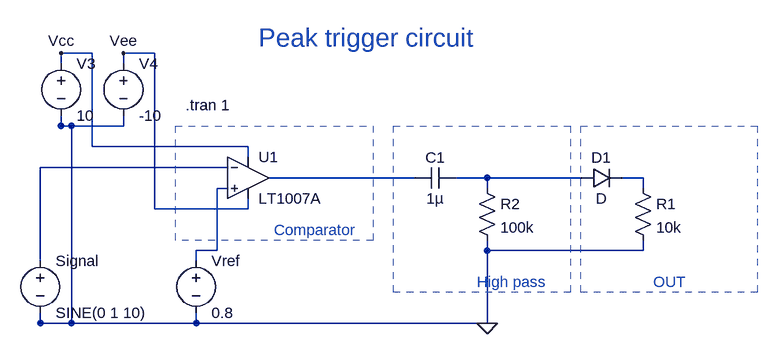
[diagram p0: schematic Peak-trigger-circuit.asc]
Peak-trigger-circuit.asc, the LTspice schematic file:
Version 4.1
SHEET 1 884 680
WIRE 704 208 704 224
WIRE 464 208 464 224
WIRE -224 320 -224 336
WIRE -192 16 -192 32
WIRE -96 16 -96 32
WIRE 16 320 16 336
WIRE 704 224 464 224
WIRE 464 224 464 336
WIRE 464 336 16 336
WIRE 16 336 -224 336
WIRE -224 336 -176 336
WIRE -176 336 -176 32
WIRE -176 32 -192 32
WIRE -192 32 -96 32
FLAG 464 336 0
WIRE -224 240 -224 224
WIRE 64 96 48 96
WIRE -224 224 -224 96
WIRE -224 96 48 96
WIRE 352 112 336 112
WIRE 128 112 144 112
WIRE 336 112 144 112
WIRE 416 112 432 112
WIRE 608 112 592 112
WIRE 464 128 464 112
WIRE 432 112 464 112
WIRE 464 112 592 112
WIRE 672 112 688 112
WIRE 704 128 704 112
WIRE 688 112 704 112
WIRE 64 128 48 128
WIRE 16 240 16 224
WIRE 48 128 48 224
WIRE 48 224 16 224
WIRE 96 80 96 64
WIRE -192 -64 -192 -80
WIRE 96 64 -144 64
WIRE -144 64 -144 -80
WIRE -144 -80 -192 -80
FLAG -192 -80 Vcc
WIRE 96 144 96 160
WIRE -96 -64 -96 -80
WIRE 96 160 -48 160
WIRE -48 160 -48 -80
WIRE -48 -80 -96 -80
FLAG -96 -80 Vee
SYMBOL Opamps\\LT1007A 96 48 R0
SYMATTR InstName U1
SYMBOL voltage -224 224 R0
WINDOW 123 0 0 Left 2
WINDOW 39 0 0 Left 2
SYMATTR InstName Signal
SYMATTR Value SINE(0 1 10)
SYMBOL voltage 16 224 R0
WINDOW 123 0 0 Left 2
WINDOW 39 0 0 Left 2
SYMATTR InstName Vref
SYMATTR Value 0.8
SYMBOL voltage -192 -80 R0
WINDOW 123 0 0 Left 2
WINDOW 39 0 0 Left 2
SYMATTR InstName V3
SYMATTR Value 10
SYMBOL voltage -96 -80 R0
WINDOW 123 0 0 Left 2
WINDOW 39 0 0 Left 2
SYMATTR InstName V4
SYMATTR Value -10
SYMBOL res 448 112 R0
SYMATTR InstName R2
SYMATTR Value 100k
SYMBOL cap 416 96 R90
WINDOW 0 0 32 VBottom 2
WINDOW 3 32 32 VTop 2
SYMATTR InstName C1
SYMATTR Value 1µ
SYMBOL diode 608 128 R270
WINDOW 0 32 32 VTop 2
WINDOW 3 0 32 VBottom 2
SYMATTR InstName D1
SYMBOL res 688 112 R0
SYMATTR InstName R1
SYMATTR Value 10k
TEXT 0 0 Left 2 !.tran 1
TEXT 136 192 Left 2 ;Comparator
TEXT 448 272 Left 2 ;High pass
TEXT 720 272 Left 2 ;OUT
TEXT 112 -104 Left 4 ;Peak trigger circuit
RECTANGLE Normal 288 208 -16 32 2
RECTANGLE Normal 592 288 320 32 2
RECTANGLE Normal 880 288 608 32 2

The netlist it stands for:
* Peak-trigger-circuit.asc
X§U1 N005 N001 Vcc Vee N002 LT1007A  ; pins In+ In- V+ V- OUT
V§Signal N001 0 SINE(0 1 10)
Vref N005 0 0.8
V3 Vcc 0 10
V4 Vee 0 -10
R2 N003 0 100k
C1 N003 N002 1µ
D1 N003 N004 D
R1 N004 0 10k
.model D D
.lib standard.dio
.tran 1
* Comparator
* High pass
* OUT
* Peak trigger circuit
.backanno
.end